# Altium schematic sheet Secondary_MCU_Lidar_Robot.SchDoc
size A
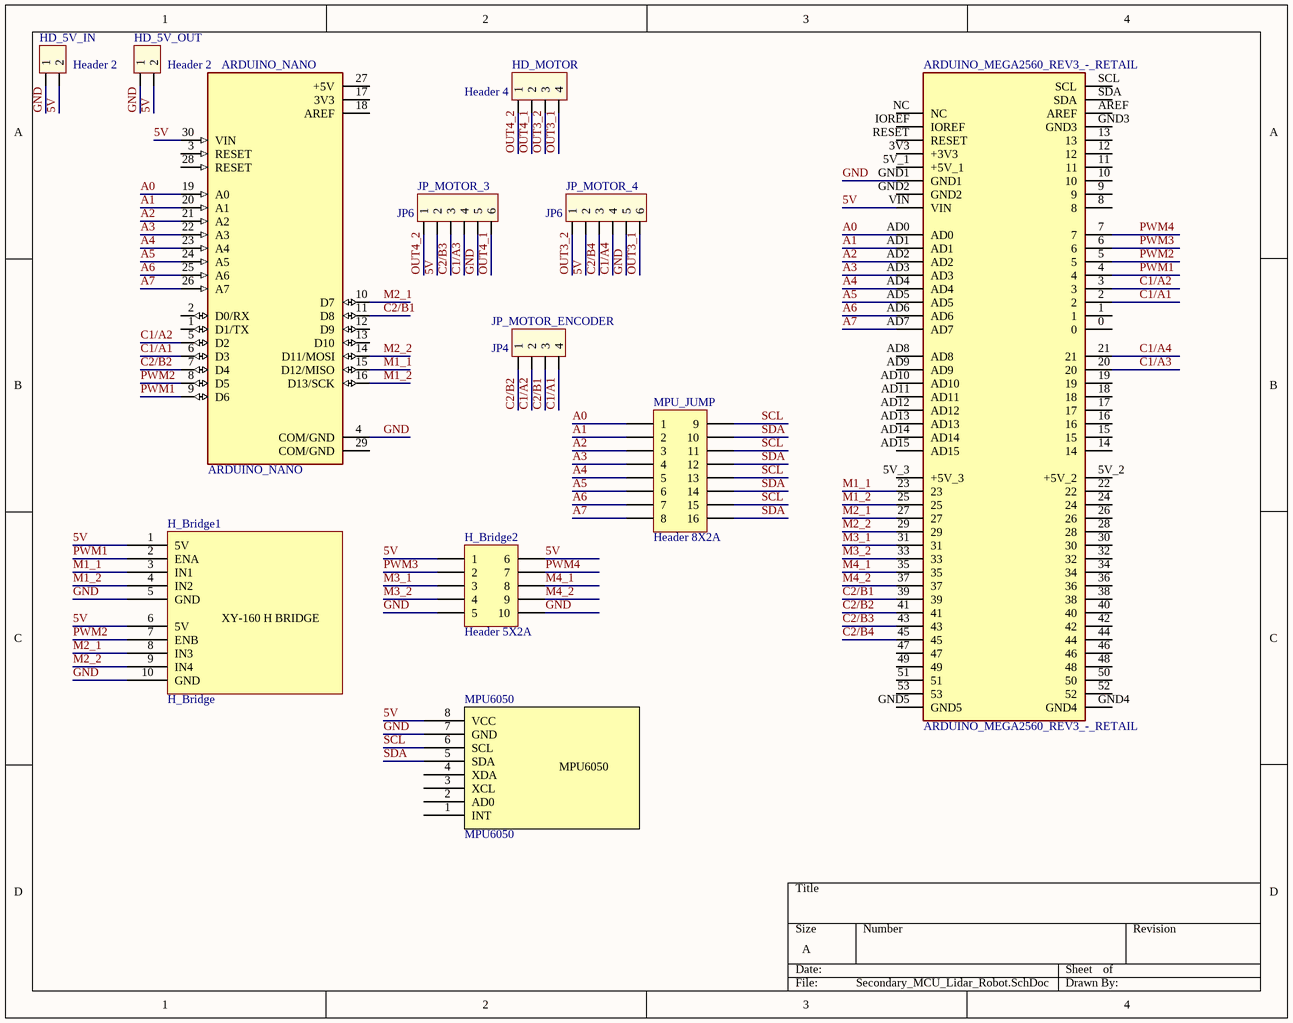
[diagram p0: Secondary_MCU_Lidar_Robot.SchDoc]

## Parts
ARDUINO_MEGA2560_REV3_-_RETAIL  ARDUINO_MEGA2560_REV3_-_RETAIL  [ARDUINO_MEGA2560_REV3_-_RETAIL]
ARDUINO_NANO  ARDUINO_NANO  [SHIELD_ARDUINO_NANO]
H_Bridge1  H_Bridge  [XY-160D]
H_Bridge2  Header 5X2A  [HDR2X5_CEN]
HD_5V_IN  Header 2  [HED2T]
HD_5V_OUT  Header 2  [HED2T]
HD_MOTOR  Header 4  [HED4T]
JP_MOTOR_3  JP6  [CON6]
JP_MOTOR_4  JP6  [CON6]
JP_MOTOR_ENCODER  JP4  [CON4]
MPU6050  MPU6050  [MPU6050]
MPU_JUMP  Header 8X2A  [HDR2X8_CEN]

## Nets
5V: ARDUINO_MEGA2560_REV3_-_RETAIL.VIN ARDUINO_NANO.30(VIN) H_Bridge1.1(5V) H_Bridge1.6(5V) H_Bridge2.1 H_Bridge2.6 HD_5V_IN.2 HD_5V_OUT.2 JP_MOTOR_3.2 JP_MOTOR_4.2 MPU6050.8(VCC)
A0: ARDUINO_MEGA2560_REV3_-_RETAIL.AD0 ARDUINO_NANO.19(A0) MPU_JUMP.1
A1: ARDUINO_MEGA2560_REV3_-_RETAIL.AD1 ARDUINO_NANO.20(A1) MPU_JUMP.2
A2: ARDUINO_MEGA2560_REV3_-_RETAIL.AD2 ARDUINO_NANO.21(A2) MPU_JUMP.3
A3: ARDUINO_MEGA2560_REV3_-_RETAIL.AD3 ARDUINO_NANO.22(A3) MPU_JUMP.4
A4: ARDUINO_MEGA2560_REV3_-_RETAIL.AD4 ARDUINO_NANO.23(A4) MPU_JUMP.5
A5: ARDUINO_MEGA2560_REV3_-_RETAIL.AD5 ARDUINO_NANO.24(A5) MPU_JUMP.6
A6: ARDUINO_MEGA2560_REV3_-_RETAIL.AD6 ARDUINO_NANO.25(A6) MPU_JUMP.7
A7: ARDUINO_MEGA2560_REV3_-_RETAIL.AD7 ARDUINO_NANO.26(A7) MPU_JUMP.8
C1/A1: ARDUINO_MEGA2560_REV3_-_RETAIL.2 ARDUINO_NANO.6(D3) JP_MOTOR_ENCODER.4
C1/A2: ARDUINO_MEGA2560_REV3_-_RETAIL.3 ARDUINO_NANO.5(D2) JP_MOTOR_ENCODER.2
C1/A3: ARDUINO_MEGA2560_REV3_-_RETAIL.20 JP_MOTOR_3.4
C1/A4: ARDUINO_MEGA2560_REV3_-_RETAIL.21 JP_MOTOR_4.4
C2/B1: ARDUINO_MEGA2560_REV3_-_RETAIL.39 ARDUINO_NANO.11(D8) JP_MOTOR_ENCODER.3
C2/B2: ARDUINO_MEGA2560_REV3_-_RETAIL.41 ARDUINO_NANO.7(D4) JP_MOTOR_ENCODER.1
C2/B3: ARDUINO_MEGA2560_REV3_-_RETAIL.43 JP_MOTOR_3.3
C2/B4: ARDUINO_MEGA2560_REV3_-_RETAIL.45 JP_MOTOR_4.3
GND: ARDUINO_MEGA2560_REV3_-_RETAIL.GND1 ARDUINO_NANO.4(COM/GND) H_Bridge1.5(GND) H_Bridge1.10(GND) H_Bridge2.5 H_Bridge2.10 HD_5V_IN.1 HD_5V_OUT.1 JP_MOTOR_3.5 JP_MOTOR_4.5 MPU6050.7(GND)
M1_1: ARDUINO_MEGA2560_REV3_-_RETAIL.23 ARDUINO_NANO.15(D12/MISO) H_Bridge1.3(IN1)
M1_2: ARDUINO_MEGA2560_REV3_-_RETAIL.25 ARDUINO_NANO.16(D13/SCK) H_Bridge1.4(IN2)
M2_1: ARDUINO_MEGA2560_REV3_-_RETAIL.27 ARDUINO_NANO.10(D7) H_Bridge1.8(IN3)
M2_2: ARDUINO_MEGA2560_REV3_-_RETAIL.29 ARDUINO_NANO.14(D11/MOSI) H_Bridge1.9(IN4)
M3_1: ARDUINO_MEGA2560_REV3_-_RETAIL.31 H_Bridge2.3
M3_2: ARDUINO_MEGA2560_REV3_-_RETAIL.33 H_Bridge2.4
M4_1: ARDUINO_MEGA2560_REV3_-_RETAIL.35 H_Bridge2.8
M4_2: ARDUINO_MEGA2560_REV3_-_RETAIL.37 H_Bridge2.9
OUT3_1: HD_MOTOR.4 JP_MOTOR_4.6
OUT3_2: HD_MOTOR.3 JP_MOTOR_4.1
OUT4_1: HD_MOTOR.2 JP_MOTOR_3.6
OUT4_2: HD_MOTOR.1 JP_MOTOR_3.1
PWM1: ARDUINO_MEGA2560_REV3_-_RETAIL.4 ARDUINO_NANO.9(D6) H_Bridge1.2(ENA)
PWM2: ARDUINO_MEGA2560_REV3_-_RETAIL.5 ARDUINO_NANO.8(D5) H_Bridge1.7(ENB)
PWM3: ARDUINO_MEGA2560_REV3_-_RETAIL.6 H_Bridge2.2
PWM4: ARDUINO_MEGA2560_REV3_-_RETAIL.7 H_Bridge2.7
SCL: MPU6050.6(SCL) MPU_JUMP.9 MPU_JUMP.11 MPU_JUMP.13 MPU_JUMP.15
SDA: MPU6050.5(SDA) MPU_JUMP.10 MPU_JUMP.12 MPU_JUMP.14 MPU_JUMP.16

Not connected (* = marked no-connect by the designer): ARDUINO_MEGA2560_REV3_-_RETAIL 0 1 3V3(+3V3) 5V_1(+5V_1) 5V_2(+5V_2) 5V_3(+5V_3) 8 9 10 11 12 13 14 15 16 17 18 19 22 24 26 28 30 32 34 36 38 40 42 44 46 47 48 49 50 51 52 53 AD8 AD9 AD10 AD11 AD12 AD13 AD14 AD15 AREF GND2 GND3 GND4 GND5 IOREF NC RESET SCL SDA; ARDUINO_NANO 1(D1/TX) 2(D0/RX) 3(RESET) 12(D9) 13(D10) 17(3V3) 18(AREF) 27(+5V) 28(RESET) 29(COM/GND); MPU6050 1(INT) 2(AD0) 3(XCL) 4(XDA)

## Notes on the sheet
- (in symbol Driver H Bridge XY160D) XY-160 H BRIDGE

## Library data of the parts
ARDUINO_MEGA2560_REV3_-_RETAIL = ARDUINO_MEGA2560_REV3_-_RETAIL: Dev.kit: Arduino; SPI, TWI, UART; ICSP, USB B, pin strips, supply; MP: ARDUINO MEGA2560 REV3 - RETAIL; Package: None; MF: Arduino; Price: None; Availability: Unavailable; SnapEDA_Link: https://www.snapeda.com/parts/ARDUINO%20MEGA2560%20REV3%20-%20RETAIL/Arduino/view-part/1128250/?ref=snap; Value: *
ARDUINO_NANO = ARDUINO_NANO: ATSAMD21G18A Arduino Nano 33 IoT SAM D ARMÂ® CortexÂ®-M0+ MCU 32-Bit Embedded Evaluation Board; MP: ARDUINO NANO; Package: None; Price: None; Availability: Unavailable; Value: *; MF: Arduino; SnapEDA_Link: https://www.snapeda.com/parts/ARDUINO%20NANO/Arduino/view-part/1128261/?ref=snap
H_Bridge1 = Driver H Bridge XY160D
H_Bridge2 = Header 5X2A: Header, 5-Pin, Dual row; LatestRevisionDate: 17-Jul-2002; LatestRevisionNote: Re-released for DXP Platform.; Publisher: Altium Limited
HD_5V_IN HD_5V_OUT = Hed2: Header 2 (Green); Value: Header 2
HD_MOTOR = Hed4: Header 4 (Green); Value: Header 4
JP_MOTOR_3 JP_MOTOR_4 = Con6: Connector 6; Value: Connector 6
JP_MOTOR_ENCODER = Con4: Connector 4; Value: Connector 4
MPU_JUMP = Header 8X2A: Header, 8-Pin, Dual row; LatestRevisionDate: 17-Jul-2002; LatestRevisionNote: Re-released for DXP Platform.; Publisher: Altium Limited